# EAGLE design untitled (EAGLE 7.5.0)
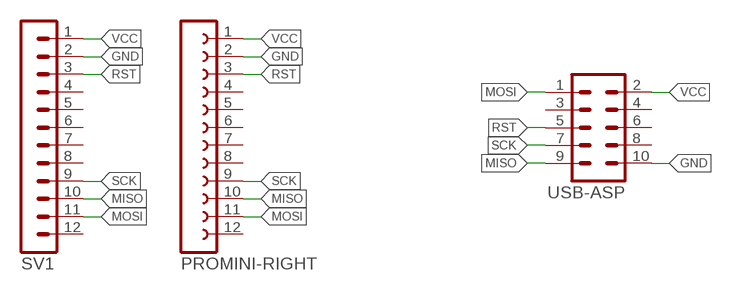
[diagram p0: schematic, sheet 1]

## Parts
PROMINI-RIGHT  FE12-1  [FE12]
SV1  MA12-1  [MA12-1]
USB-ASP  MA05-2  [MA05-2]

## Nets
GND: PROMINI-RIGHT.2 SV1.2 USB-ASP.10
MISO: PROMINI-RIGHT.10 SV1.10 USB-ASP.9
MOSI: PROMINI-RIGHT.11 SV1.11 USB-ASP.1
RST: PROMINI-RIGHT.3 SV1.3 USB-ASP.5
SCK: PROMINI-RIGHT.9 SV1.9 USB-ASP.7
VCC: PROMINI-RIGHT.1 SV1.1 USB-ASP.2
Unconnected: PROMINI-RIGHT.4 PROMINI-RIGHT.5 PROMINI-RIGHT.6 PROMINI-RIGHT.7 PROMINI-RIGHT.8 PROMINI-RIGHT.12 SV1.4 SV1.5 SV1.6 SV1.7 SV1.8 SV1.12 USB-ASP.3 USB-ASP.4 USB-ASP.6 USB-ASP.8

## Library data of the parts
PROMINI-RIGHT = con-lsta:FE12-1: FEMALE HEADER; OC_FARNELL: unknown; OC_NEWARK: unknown
SV1 = con-lstb:MA12-1: PIN HEADER; OC_FARNELL: unknown; OC_NEWARK: unknown
USB-ASP = con-lstb:MA05-2: PIN HEADER; OC_FARNELL: unknown; OC_NEWARK: unknown

## Board
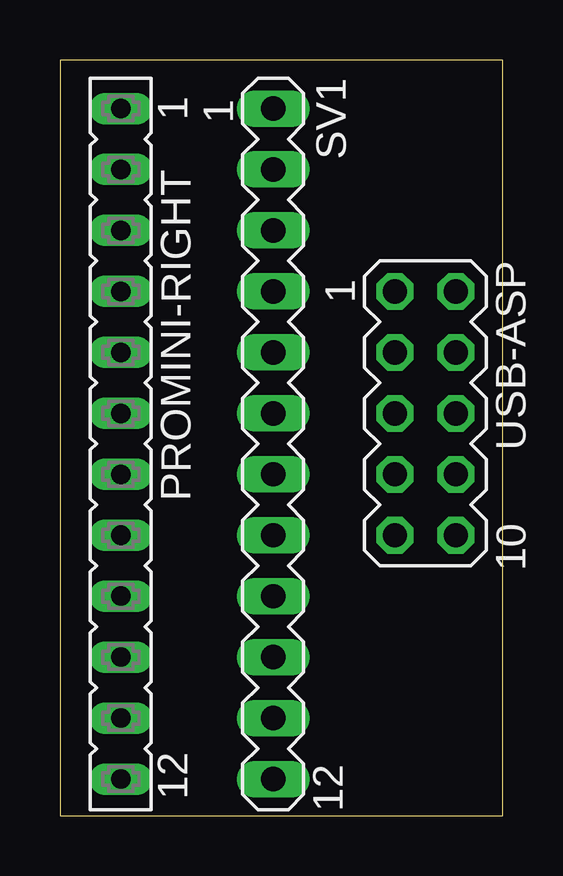
[diagram p1: board, top side]
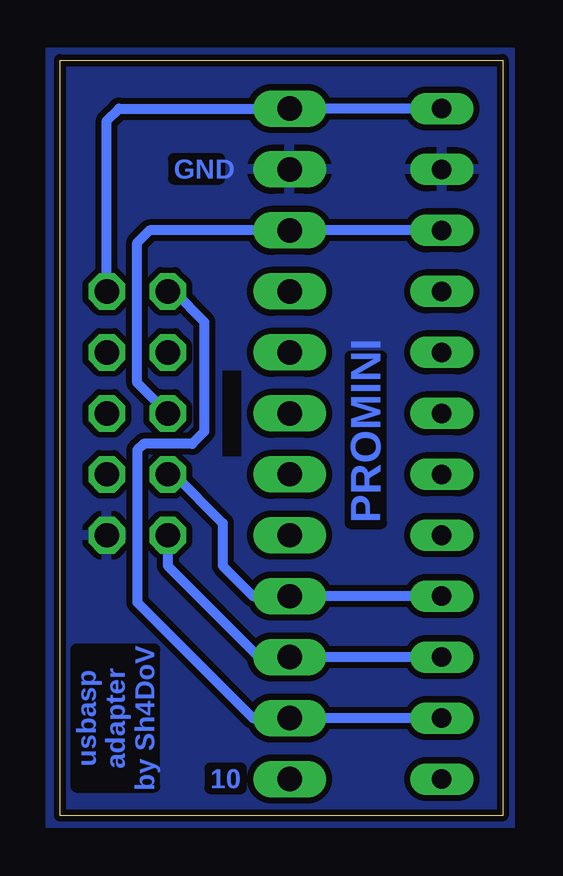
[diagram p2: board, bottom side, seen from below]

Size 18.47 x 31.49 mm. Coordinates in mm from the lower left corner, seen from the top.
Outline: 0,0 18.47,0 18.47,31.49 0,31.49 0,0
Copper layers (1*16): Top 0.035mm / dielectric 1.5mm / Bottom 0.035mm
Design rules "default 10mils": minimum track width 10mil, minimum drill 24mil, track to track 10mil, track to pad 10mil, pad to pad 10mil, via to via 10mil, smd to smd 10mil, copper to edge 10mil, drill to drill 10mil, minimum pad ring 10mil, minimum via ring 8mil, stop-mask expansion 4mil, vias tented up to drill 0mil, thermal gap 12mil
bRestrict: area 10.9,15 to 11.7,18.5

### Footprints (pad centres in the part's own frame; a part is rotated, then mirrored left to right if it is on the bottom)
FE12 = drill 0.813 long: 1 -13.97,0; 2 -11.43,0; 3 -8.89,0; 4 -6.35,0; 5 -3.81,0; 6 -1.27,0; 7 1.27,0; 8 3.81,0; 9 6.35,0; 10 8.89,0; 11 11.43,0; 12 13.97,0
MA12-1 = drill 1.016 long: 1 -13.97,0; 2 -11.43,0; 3 -8.89,0; 4 -6.35,0; 5 -3.81,0; 6 -1.27,0; 7 1.27,0; 8 3.81,0; 9 6.35,0; 10 8.89,0; 11 11.43,0; 12 13.97,0
MA05-2 = drill 1.016 octagon: 1 -5.08,-1.27; 2 -5.08,1.27; 3 -2.54,-1.27; 4 -2.54,1.27; 5 0,-1.27; 6 0,1.27; 7 2.54,-1.27; 8 2.54,1.27; 9 5.08,-1.27; 10 5.08,1.27

### Placement (x,y rotation side)
PROMINI-RIGHT  2.54,15.49 270 top
SV1  8.89,15.49 270 top
USB-ASP  15.24,16.76 270 top

### Tracks (layer width: path | path; a pad name or v marks a point on that pad's centre or on a via)
GND
  pour Bottom: -0.51,-0.51 18.8,-0.51 18.8,32 -0.51,32
MISO
  Bottom 0.406: PROMINI-RIGHT.10 SV1.10 10.16,6.6 13.97,10.41 USB-ASP.9
MOSI
  Bottom 0.406: PROMINI-RIGHT.11 SV1.11 10.41,4.06 15.24,8.89 15.24,15.24 14.99,15.49 12.95,15.49 12.45,16 12.45,20.57 13.72,21.84 USB-ASP.1
N$2
  pour Bottom: -0.51,32 19.05,32 19.05,-0.51 -0.51,-0.51
RST
  Bottom 0.406: PROMINI-RIGHT.3 SV1.3 14.73,24.38 15.24,23.88 15.24,18.03 USB-ASP.5
SCK
  Bottom 0.406: PROMINI-RIGHT.9 SV1.9 10.41,9.14 11.68,10.41 11.68,12.19 13.72,14.22 USB-ASP.7
VCC
  Bottom 0.406: PROMINI-RIGHT.1 SV1.1 16,29.46 16.51,28.96 USB-ASP.2

### Text on the board
Bottom: GND | PROMINI | usbasp / adapter / by Sh4DoV | 10